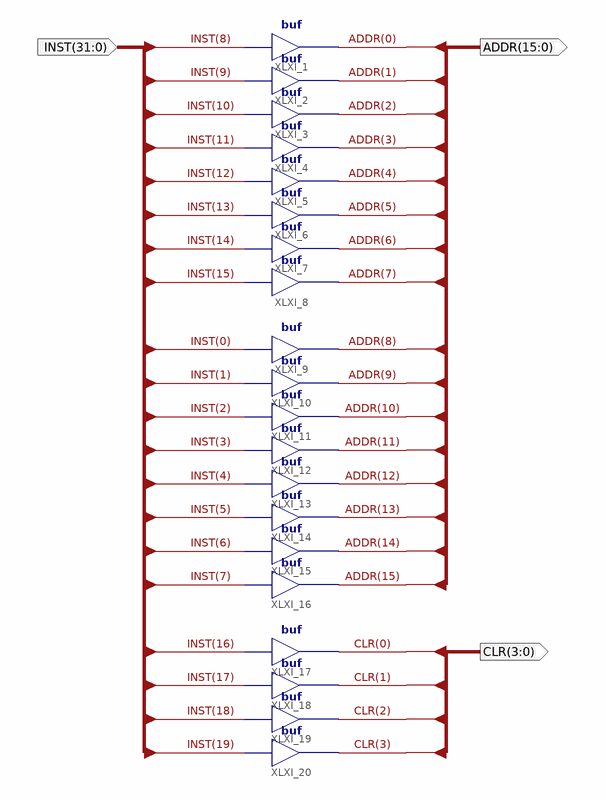
[diagram p0: schematic sheet 1]
// Xilinx ISE schematic decoder.sch (spartan6) as structural Verilog: 20 symbols, 3 ports
module decoder (
  input  [31:0] INST,
  output [3:0] CLR,
  output [15:0] ADDR
);

  buf XLXI_1 (ADDR[0], INST[8]);
  buf XLXI_2 (ADDR[1], INST[9]);
  buf XLXI_3 (ADDR[2], INST[10]);
  buf XLXI_4 (ADDR[3], INST[11]);
  buf XLXI_5 (ADDR[4], INST[12]);
  buf XLXI_6 (ADDR[5], INST[13]);
  buf XLXI_7 (ADDR[6], INST[14]);
  buf XLXI_8 (ADDR[7], INST[15]);
  buf XLXI_17 (CLR[0], INST[16]);
  buf XLXI_18 (CLR[1], INST[17]);
  buf XLXI_19 (CLR[2], INST[18]);
  buf XLXI_20 (CLR[3], INST[19]);
  buf XLXI_9 (ADDR[8], INST[0]);
  buf XLXI_10 (ADDR[9], INST[1]);
  buf XLXI_11 (ADDR[10], INST[2]);
  buf XLXI_12 (ADDR[11], INST[3]);
  buf XLXI_13 (ADDR[12], INST[4]);
  buf XLXI_14 (ADDR[13], INST[5]);
  buf XLXI_15 (ADDR[14], INST[6]);
  buf XLXI_16 (ADDR[15], INST[7]);
endmodule
